# EAGLE schematic PiPSU (EAGLE 6.1)
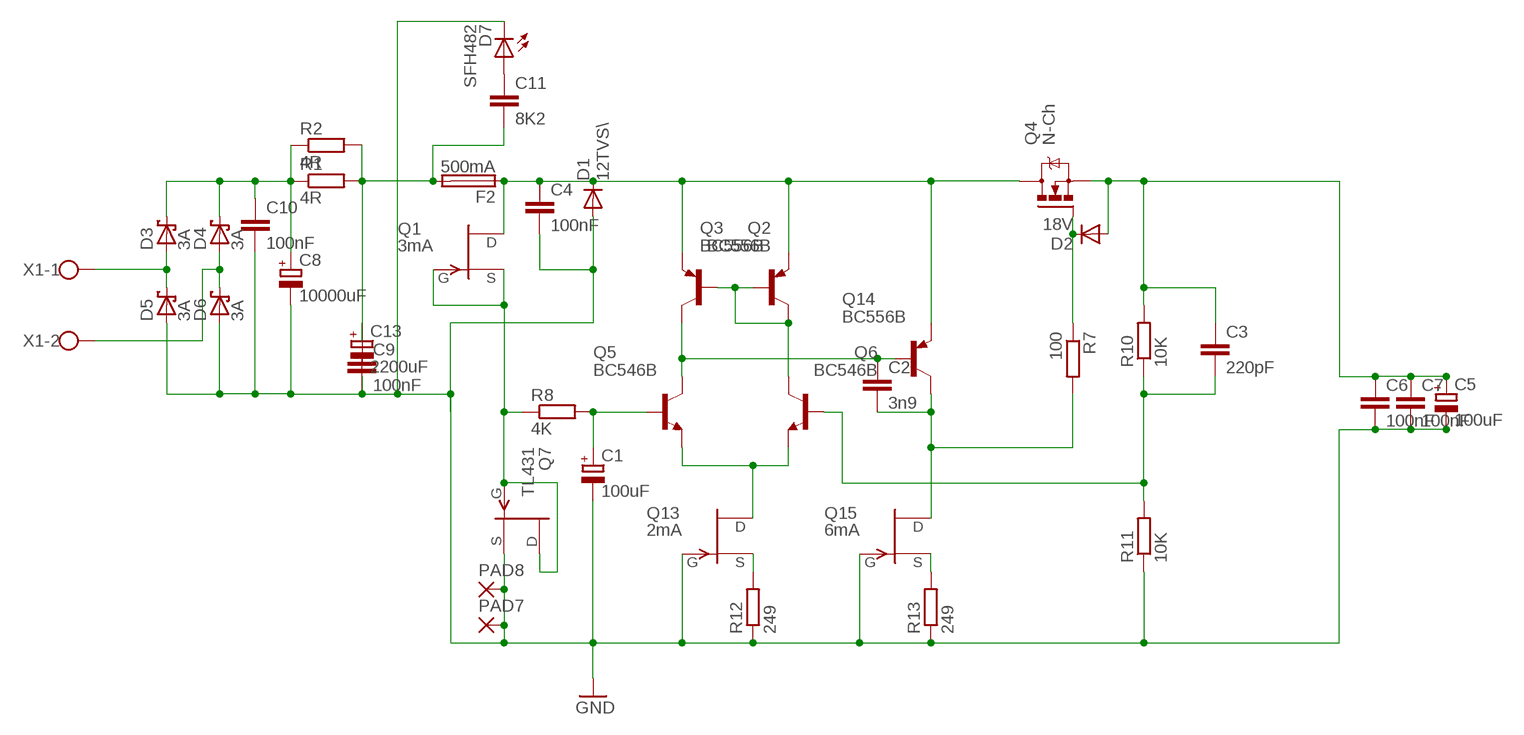
[diagram p0: schematic, sheet 1]

## Parts
C1  100uF  CPOL-EUE3.5-8  [E3,5-8]
C2  3n9  C-EUC1210K  [C1210K]
C3  220pF  C-EUC1210  [C1210]
C4  100nF  C-EUC1210  [C1210]
C5  100uF  CPOL-EUE3.5-8  [E3,5-8]
C6  100nF  C-EUC1210  [C1210]
C7  100nF  C-EUC1210  [C1210]
C8  10000uF  CPOL-EUE7.5-18  [E7,5-18]
C9  100nF  C-EU102-043X133  [C102-043X133]
C10  100nF  C-EUC1210  [C1210]
C11  8K2  C-EUC1210  [C1210]
C13  2200uF  CPOL-EUE7.5-18  [E7,5-18]
D1  12TVS\  1N4148DO35-10  [DO35-10]
D2  18V  1N4148DO35-7  [DO35-7]
D3  3A  MBRS330T3  [SMC]
D4  3A  MBRS330T3  [SMC]
D5  3A  MBRS330T3  [SMC]
D6  3A  MBRS330T3  [SMC]
D7  SFH482  [SFH482]
F2  500mA  19560  [19560]
PAD7  3,81/1,4  [3,81/1,4]
PAD8  3,81/1,4  [3,81/1,4]
Q1  3mA  2N5484  [TO92-]
Q2  BC556B  BC560  [TO92-EBC]
Q3  BC556B  BC560  [TO92-EBC]
Q4  N-Ch  IXFH_6N90  [TO-247AD-H]
Q5  BC546B  BC550B  [TO92-EBC]
Q6  BC546B  BC550B  [TO92-EBC]
Q7  TL431  2N5484  [TO92-]
Q13  2mA  2N5484  [TO92-]
Q14  BC556B  BC560  [TO92-EBC]
Q15  6mA  2N5484  [TO92-]
R1  4R  R-EU_0309/12  [0309/12]
R2  4R  R-EU_0309/12  [0309/12]
R7  100  R-EU_0309/12  [0309/12]
R8  4K  R-EU_0309/12  [0309/12]
R10  10K  R-EU_R1210  [R1210]
R11  10K  R-EU_R1210  [R1210]
R12  249  R-EU_R1210  [R1210]
R13  249  R-EU_R1210  [R1210]
X1  W237-102  [W237-102]

## Nets
FGD: C1.- C4.2 C5.- C6.2 C7.2 C8.- C9.2 C10.2 C13.- D1.A D5.A D6.A D7.K(C) PAD7.1(P) PAD8.1(P) Q7.2(S) Q13.1(G) Q15.1(G) R11.1 R12.1 R13.1 ; supply symbol labelled GND
N$1: C9.1 C11.2 C13.+ F2.2 R1.2 R2.2
N$3: C8.+ C10.1 D3.C D4.C R1.1 R2.1
N$4: D3.A D5.C X1.1
N$5: D4.A D6.C X1.2
N$7: C3.1 C5.+ C6.1 C7.1 D2.A Q4.S R10.2
N$8: C4.1 D1.C F2.1 Q1.3(D) Q2.E Q3.E Q4.D Q14.E
N$9: C11.1 D7.A
N$11: D2.C Q4.G R7.1
N$12: C1.+ Q5.B R8.2
N$15: Q2.B Q3.B Q3.C Q6.C
N$16: Q5.E Q6.E Q13.3(D)
N$17: C2.1 Q2.C Q5.C Q14.B
N$19: C2.2 Q14.C Q15.3(D) R7.2
N$20: C3.2 Q6.B R10.1 R11.2
N$22: Q1.1(G) Q1.2(S) Q7.1(G) Q7.3(D) R8.1
N$23: Q13.2(S) R12.2
N$24: Q15.2(S) R13.2

## Library data of the parts
C1 C5 C8 C13 = resistor:CPOL-EU: POLARIZED CAPACITOR, European symbol
C2-C4 C6 C7 C9-C11 = resistor:C-EU: CAPACITOR, European symbol
D1 D2 = diode:1N4148: DIODE high speed (Philips)
D3-D6 = diode:MBRS3*0T3: SCHOTTKY BARRIER RECTIFIER 3.0 AMPERES 20, 30, 40 VOLT Source: MBRS340T3-D.pdf
D7 = led:SFH482: IR LED infrared emitting diode, Infineon
F2 = fuse:19560: FUSE HOLDER TR5, Wickmann
PAD7 PAD8 = wirepad:3,81/1,4: THROUGH-HOLE PAD
Q1 Q7 Q13 Q15 = transistor-fet:?548*: N-Channel JFETs Source: VISHAY 2N5484.pdf Compatible: TO92 2N5245 J304 J305 U310 J308 J309 J310 TO72 2N4416 2N4416A 2N3823 2N4351 3N169 3N170 3N171 MFE3002 TO18 2N3796 2N3797 MFE825 Source: Motorola European Master Guide Pacge 3-59
Q2 Q3 Q14 = transistor-pnp:BC560*: PNP Transistror
Q4 = transistor-power:IXF?6N*: HiPerFET (TM) Power MOSFET N-Channel Enhancement Mode HDMOS Family Source: http://www.ixys.com/91529.pdf
Q5 Q6 = transistor-npn:BC550*: NPN Transistor
R1 R2 R7 R8 R10-R13 = resistor:R-EU_: RESISTOR, European symbol
X1 = con-wago-500:W237-102: WAGO SCREW CLAMP; MPN: 237-102; OC_FARNELL: unknown; OC_NEWARK: 70K9898